# EAGLE design rcl_mini (EAGLE 8.0.1)
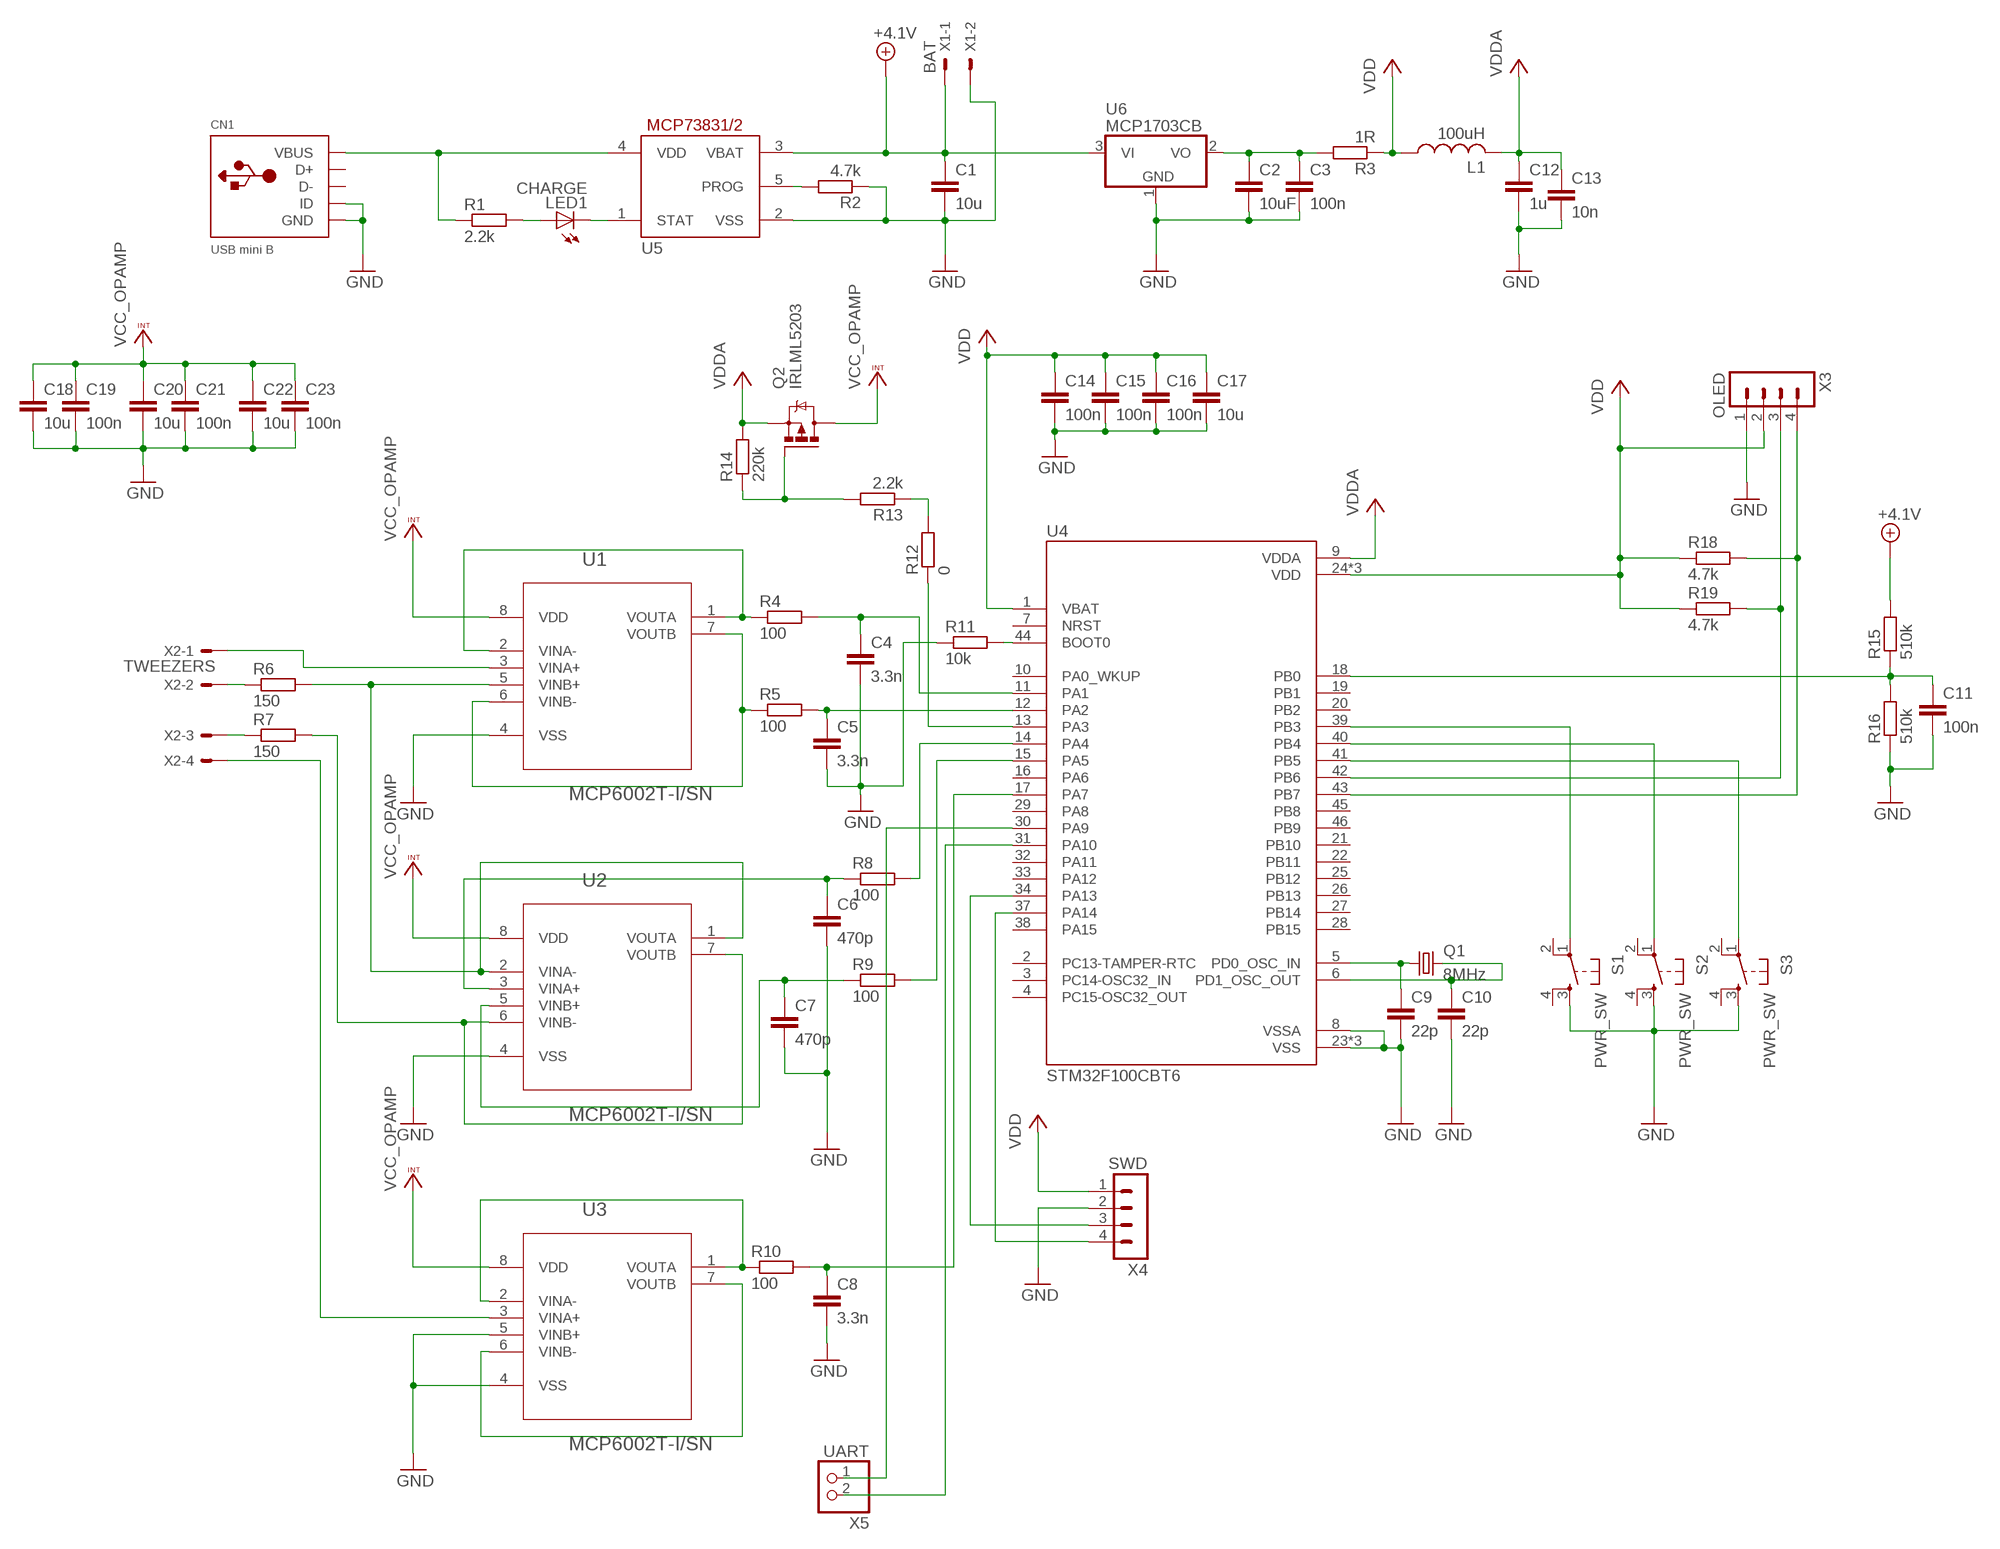
[diagram p0: schematic, sheet 1]

## Parts
C1  10u  C-EUC0805  [C0805]
C2  10uF  C-EUC0805  [C0805]
C3  100n  C-EUC0805  [C0805]
C4  3.3n  C-EUC0805  [C0805]
C5  3.3n  C-EUC0805  [C0805]
C6  470p  C-EUC0805  [C0805]
C7  470p  C-EUC0805  [C0805]
C8  3.3n  C-EUC0805  [C0805]
C9  22p  C-EUC0805  [C0805]
C10  22p  C-EUC0805  [C0805]
C11  100n  C-EUC0805  [C0805]
C12  1u  C-EUC0805  [C0805]
C13  10n  C-EUC0805  [C0805]
C14  100n  C-EUC0805  [C0805]
C15  100n  C-EUC0805  [C0805]
C16  100n  C-EUC0805  [C0805]
C17  10u  C-EUC0805  [C0805]
C18  10u  C-EUC0805  [C0805]
C19  100n  C-EUC0805  [C0805]
C20  10u  C-EUC0805  [C0805]
C21  100n  C-EUC0805  [C0805]
C22  10u  C-EUC0805  [C0805]
C23  100n  C-EUC0805  [C0805]
CN1  USB mini B  USBMINIB  [USB-MINIB]
L1  100uH  L-USL3216C  [L3216C]
LED1  CHARGE  LEDCHIPLED_1206  [CHIPLED_1206]
Q1  8MHz  CRYSTALHC49UP  [HC49UP]
Q2  IRLML5203  [MICRO3]
R1  2.2k  R-EU_M0805  [M0805]
R2  4.7k  R-EU_M0805  [M0805]
R3  1R  R-EU_M0805  [M0805]
R4  100  R-EU_M0805  [M0805]
R5  100  R-EU_M0805  [M0805]
R6  150  R-EU_M0805  [M0805]
R7  150  R-EU_M0805  [M0805]
R8  100  R-EU_M0805  [M0805]
R9  100  R-EU_M0805  [M0805]
R10  100  R-EU_M0805  [M0805]
R11  10k  R-EU_M0805  [M0805]
R12  0  R-EU_R1206  [R1206]
R13  2.2k  R-EU_M0805  [M0805]
R14  220k  R-EU_M0805  [M0805]
R15  510k  R-EU_M0805  [M0805]
R16  510k  R-EU_M0805  [M0805]
R18  4.7k  R-EU_M0805  [M0805]
R19  4.7k  R-EU_M0805  [M0805]
S1  PWR_SW  DTS-6  [DTS-6]
S2  PWR_SW  DTS-6  [DTS-6]
S3  PWR_SW  DTS-6  [DTS-6]
U1  MCP6002T-I/SN  MCP6002-E/SN  [SOIC127P600X175-8N]
U2  MCP6002T-I/SN  MCP6002-E/SN  [SOIC127P600X175-8N]
U3  MCP6002T-I/SN  MCP6002-E/SN  [SOIC127P600X175-8N]
U4  STM32F100CBT6  STM32F103C8T6  [QFP50P900X900X160-48N]
U5  MCP73831/OT  [SOT23-5L]
U6  MCP1703CB  [SOT23]
UART  X5  PINHD-1X2  [1X02]
X1  BAT  22-23-2021  [22-23-2021]
X2  TWEEZERS  22-23-2041  [22-23-2041]
X3  OLED  MA04-1  [MA04-1]
X4  SWD  MA04-1  [MA04-1]

## Nets
GND [power]: C1.2 C2.2 C3.2 C4.2 C5.2 C6.2 C7.2 C8.2 C9.2 C10.2 C11.2 C12.2 C13.2 C14.2 C15.2 C16.2 C17.2 C18.2 C19.2 C20.2 C21.2 C22.2 C23.2 CN1.GND CN1.ID R2.1 R11.1 R16.1 S1.3 S2.3 S3.3 U1.4(VSS) U2.4(VSS) U3.4(VSS) U3.5(VINB+) U4.8(VSSA) U4.23(VSS) U4.35(VSS) U4.47(VSS) U5.2(VSS) U6.1(GND) X1.2 X3.1 X4.2
HCUR: R7.1 X2.3
HCUR2: R7.2 U2.6(VINB-) U2.7(VOUTB)
HPOT: U3.3(VINA+) X2.4
LCUR: R6.1 X2.2
LCUR2: R6.2 U1.5(VINB+) U2.1(VOUTA) U2.2(VINA-)
N$1: R12.2 R13.1
N$2: LED1.A R1.2
N$3: LED1.C U5.1(STAT)
N$4: R2.2 U5.5(PROG)
N$5: C2.1 C3.1 R3.2 U6.2(VO)
N$6: R4.1 U1.1(VOUTA) U1.2(VINA-)
N$7: U1.3(VINA+) X2.1
N$10: R5.1 U1.6(VINB-) U1.7(VOUTB)
N$11: C6.1 R8.1 U2.3(VINA+)
N$12: R11.2 U4.44(BOOT0)
N$15: Q2.1(G) R13.2 R14.1
N$16: C7.1 R9.1 U2.5(VINB+)
N$19: R10.1 U3.1(VOUTA) U3.2(VINA-)
N$20: C11.1 R15.1 R16.2 U4.18(PB0)
N$21: U3.6(VINB-) U3.7(VOUTB)
N$23: C9.1 Q1.1 U4.5(PD0_OSC_IN)
N$24: C10.1 Q1.2 U4.6(PD1_OSC_OUT)
OLED_I2C_SCK: R19.2 U4.42(PB6) X3.3
OLED_I2C_SDA: R18.2 U4.43(PB7) X3.4
PA1: C4.1 R4.2 U4.11(PA1)
PA2: C5.1 R5.2 U4.12(PA2)
PA3: R12.1 U4.13(PA3)
PA4: R8.2 U4.14(PA4)
PA5: R9.2 U4.15(PA5)
PA7: C8.1 R10.2 U4.17(PA7)
SW1: S1.1 U4.39(PB3)
SW2: S2.1 U4.40(PB4)
SW3: S3.1 U4.41(PB5)
SWCLK: U4.37(PA14) X4.4
SWDIO: U4.34(PA13) X4.3
UART_RX: U4.31(PA10) UART.2
UART_TX: U4.30(PA9) UART.1
USB+: CN1.VBUS R1.1 U5.4(VDD)
VBAT+: C1.1 R15.2 U5.3(VBAT) U6.3(VI) X1.1 ; supply symbol labelled +4.1V
VCC_OPAMP [power]: C18.1 C19.1 C20.1 C21.1 C22.1 C23.1 Q2.3(D) U1.8(VDD) U2.8(VDD) U3.8(VDD)
VDD: C14.1 C15.1 C16.1 C17.1 L1.1 R3.1 R18.1 R19.1 U4.1(VBAT) U4.24(VDD) U4.36(VDD) U4.48(VDD) X3.2 X4.1
VDDA: C12.1 C13.1 L1.2 Q2.2(S) R14.2 U4.9(VDDA)
Unconnected: CN1.D+ CN1.D- S1.2 S1.4 S2.2 S2.4 S3.2 S3.4 U4.2(PC13-TAMPER-RTC) U4.3(PC14-OSC32_IN) U4.4(PC15-OSC32_OUT) U4.7(NRST) U4.10(PA0_WKUP) U4.16(PA6) U4.19(PB1) U4.20(PB2) U4.21(PB10) U4.22(PB11) U4.25(PB12) U4.26(PB13) U4.27(PB14) U4.28(PB15) U4.29(PA8) U4.32(PA11) U4.33(PA12) U4.38(PA15) U4.45(PB8) U4.46(PB9)

## Library data of the parts
C1-C23 = rcl:C-EU: CAPACITOR, European symbol
CN1 = adafruit:USB: USB Connectors USBMINIB - Surface Mount Female Mini-B USB Connector 4UConnector: 06564 By microbuilder.eu Thru-hole RA Female Mini-B USB Connector 4UConnector: 18732 By ladyada.net
L1 = rcl:L-US: INDUCTOR, American symbol
LED1 = led:LED: LED OSRAM: - CHIPLED LG R971, LG N971, LY N971, LG Q971, LY Q971, LO R971, LY R971 LH N974, LH R974 LS Q976, LO Q976, LY Q976 LO Q996 - Hyper CHIPLED LW Q18S LB Q993, LB Q99A, LB R99A - SideLED LS A670, LO A670, LY A670, LG A670, LP A670 LB A673, LV A673, LT A673, LW A673 LH A674 LY A675 LS A676, LA A676, LO A676, LY A676, LW A676 LS A679, LY A679, LG A679 - Hyper Micro SIDELED® LS Y876, LA Y876, LO Y876, LY Y876 LT Y87S - SmartLED LW L88C, LW L88S LB L89C, LB L89S, LG L890 LS L89K, LO L89K, LY L89K LS L896, LA L896, LO L896, LY L896 - TOPLED LS T670, LO T670, LY T670, LG T670, LP T670 LSG T670, LSP T670, LSY T670, LOP T670, LYG T670 LG T671, LOG T671, LSG T671 LB T673, LV T673, LT T673, LW T673 LH T674 LS T676, LA T676, LO T676, LY T676, LB T676, LH T676, LSB T676, LW T676 LB T67C, LV T67C, LT T67C, LS T67K, LO T67K, LY T67K, LW E67C LS E67B, LA E67B, LO E67B, LY E67B, LB E67C, LV E67C, LT E67C LW T67C LS T679, LY T679, LG T679 LS T770, LO T770, LY T770, LG T770, LP T770 LB T773, LV T773, LT T773, LW T773 LH T774 LS E675, LA E675, LY E675, LS T675 LS T776, LA T776, LO T776, LY T776, LB T776 LHGB T686 LT T68C, LB T68C - Hyper Mini TOPLED® LB M676 - Mini TOPLED Santana® LG M470 LS M47K, LO M47K, LY M47K Source: http://www.osram.convergy.de LUXEON: - LUMILED® LXK2-PW12-R00, LXK2-PW12-S00, LXK2-PW14-U00, LXK2-PW14-V00 LXK2-PM12-R00, LXK2-PM12-S00, LXK2-PM14-U00 LXK2-PE12-Q00, LXK2-PE12-R00, LXK2-PE12-S00, LXK2-PE14-T00, LXK2-PE14-U00 LXK2-PB12-K00, LXK2-PB12-L00, LXK2-PB12-M00, LXK2-PB14-N00, LXK2-PB14-P00, LXK2-PB14-Q00 LXK2-PR12-L00, LXK2-PR12-M00, LXK2-PR14-Q00, LXK2-PR14-R00 LXK2-PD12-Q00, LXK2-PD12-R00, LXK2-PD12-S00 LXK2-PH12-R00, LXK2-PH12-S00 LXK2-PL12-P00, LXK2-PL12-Q00, LXK2-PL12-R00 Source: www.luxeon.com KINGBRIGHT: KA-3528ASYC Source: www.kingbright.com
Q1 = adafruit:CRYSTAL: CRYSTAL; OC_FARNELL: unknown; OC_NEWARK: unknown
Q2 = transistor-power:IRLML5203: HEXFET P-Channel Power MOSFET
R1-R16 R18 R19 = rcl:R-EU_: RESISTOR, European symbol
S1-S3 = switch-tact:DTS-6
U1-U3 = MCP6002:MCP6002-E/SN: Low-Power Op Amp; AVAILABILITY: Unavailable; DESCRIPTION: MCP6002 Series 6 V 1 MHz SMT Low-Power Operational Amplifier - SOIC-8; MF: Microchip; MP: MCP6002-E/SN; PACKAGE: SOIC-8 Microchip; PRICE: None
U4 = STM32F10xCx:STM32F103C8T6: Mainstream Performance line, ARM Cortex-M3 MCU with 64 Kbytes Flash, 72 MHz CPU, motor control, USB and CAN; AVAILABILITY: Unavailable; DESCRIPTION: Mainstream Performance line, ARM Cortex-M3 MCU with 64 Kbytes Flash, 72 MHz CPU, motor control, USB and CAN; MF: STMicroelectronics; MP: STM32F103C8T6; PACKAGE: LQFP-48 STMicroelectronics; PRICE: None
U5 = adafruit:MCP73831: MCP73831/2 Miniature Single-Cell, Fully Integrated Li-Ion, Li-Polymer Charge Management Controllers. Nice and small simple lipoly charge controller, with adjustable current and status output (LED) http://www.ladyada.net/library/pcb/eaglelibrary.html
U6 = linear:MCP1703: 250 mA, 16V, Low Quiescent Current LDO Regulator Source: http://ww1.microchip.com/downloads/en/DeviceDoc/22049b.pdf
UART = pinhead:PINHD-1X2: PIN HEADER
X1 = con-molex:22-23-2021: .100" (2.54mm) Center Header - 2 Pin; MF: MOLEX; MPN: 22-23-2021; OC_FARNELL: 1462926; OC_NEWARK: 25C3832
X2 = con-molex:22-23-2041: .100" (2.54mm) Center Header - 4 Pin; MF: MOLEX; MPN: 22-23-2041; OC_FARNELL: 1462920; OC_NEWARK: 38C0355
X3 X4 = con-lstb:MA04-1: PIN HEADER; OC_FARNELL: unknown; OC_NEWARK: unknown

## Net classes
0 default: width 0.4 mm
1 power: width 0.6 mm

## Board
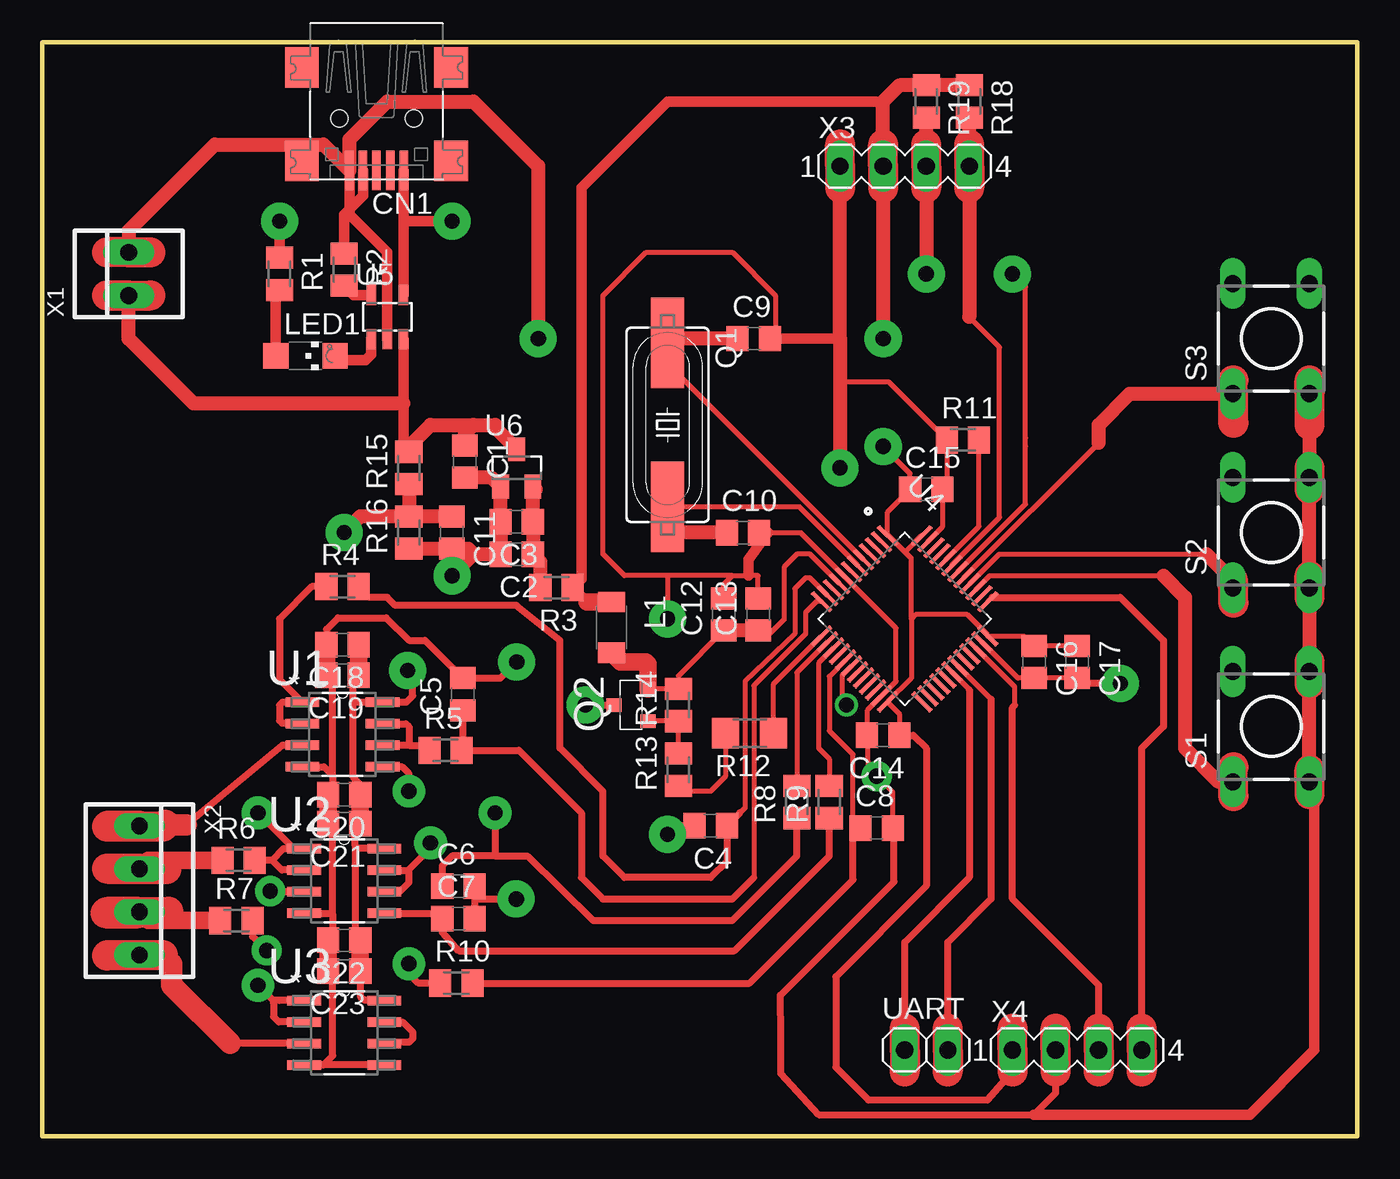
[diagram p1: board, top side]
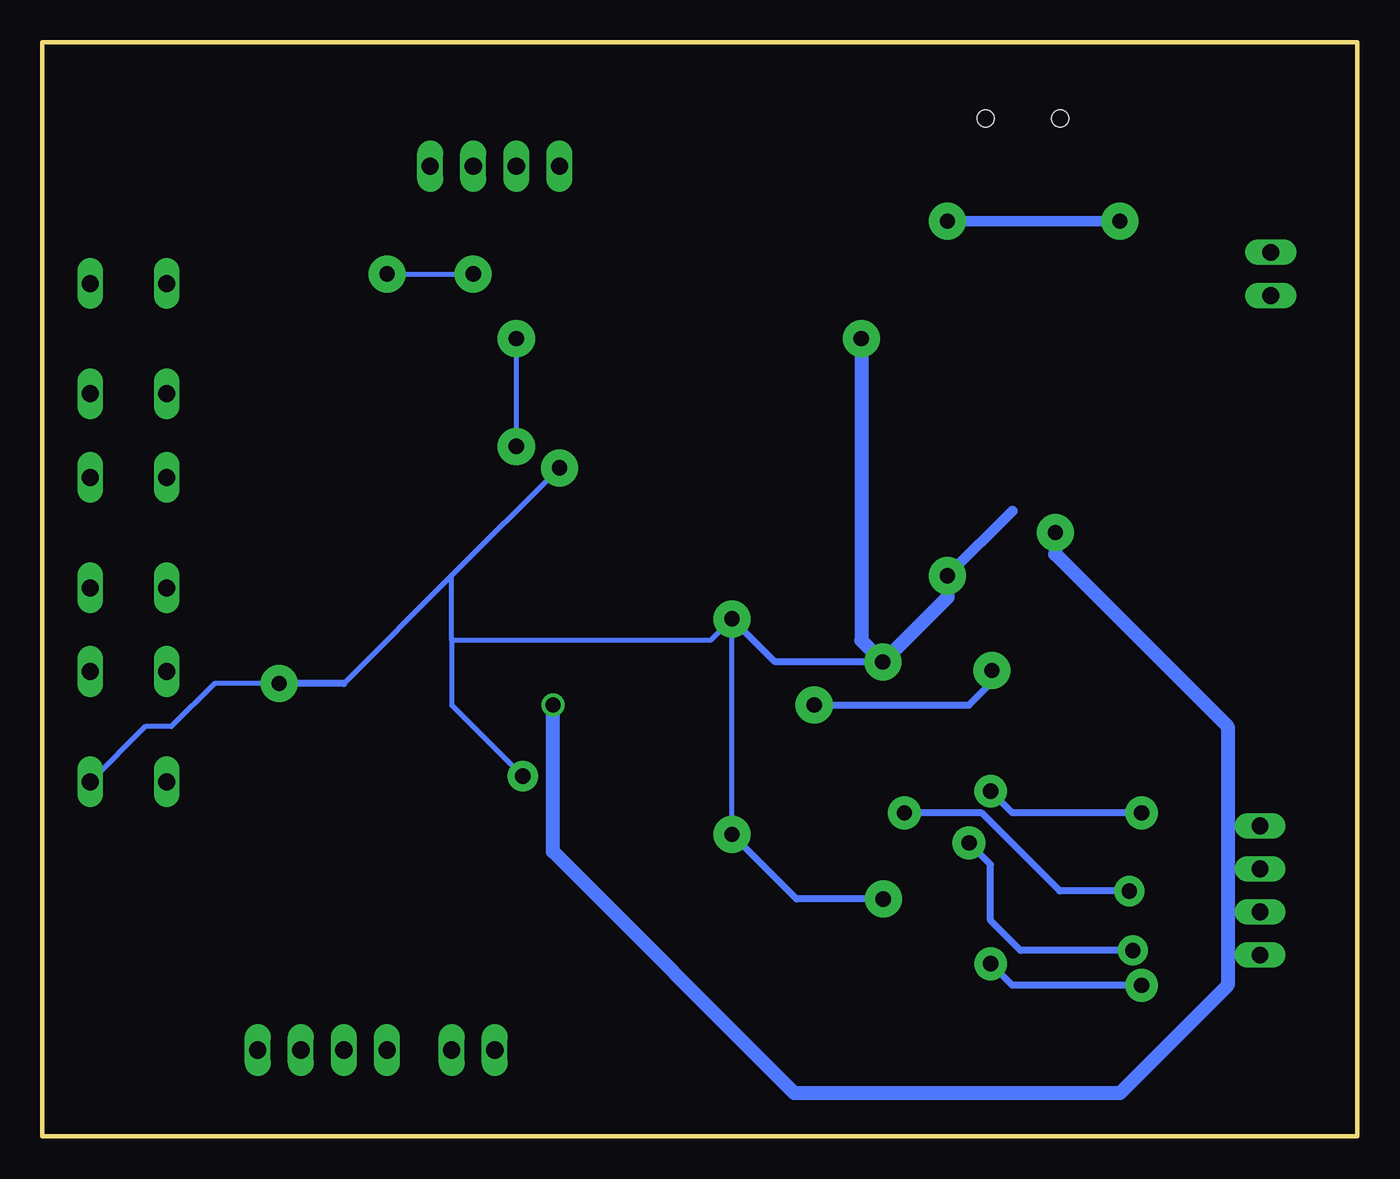
[diagram p2: board, bottom side, seen from below]

Size 77.45 x 64.44 mm. Coordinates in mm from the lower left corner, seen from the top.
Outline: 0,0 77.45,0 77.45,64.44 0,64.44 0,0
Copper layers (1*16): Top 0.035mm / dielectric 1.5mm / Bottom 0.035mm
Design rules "default": minimum track width 10mil, minimum drill 24mil, track to track 8mil, track to pad 8mil, pad to pad 8mil, via to via 8mil, smd to smd 8mil, copper to edge 40mil, drill to drill 8mil, minimum pad ring 10mil, minimum via ring 8mil, stop-mask expansion 4mil, vias tented up to drill 0mil, thermal gap 10mil

### Footprints (pad centres in the part's own frame; a part is rotated, then mirrored left to right if it is on the bottom)
C0805 = smd 1.3 x 1.5: 1 -0.95,0; 2 0.95,0
USB-MINIB = smd 0.5 x 2.308: D+ 0,4.064; D- -0.8,4.064; GND 1.6,4.064; ID 0.8,4.064; VBUS -1.6,4.064 | smd 2 x 2.4: GND1 -4.4,-2; GND2 -4.4,3.5; GND3 4.4,3.5; GND4 4.4,-2 | hole 1: -2.2,1; 2.2,1
L3216C = smd 1.2 x 1.6: 1 -1.5,0; 2 1.5,0
CHIPLED_1206 = smd 1.5 x 1.5: A 0,-1.75; C 0,1.75
HC49UP = smd 5.334 x 1.93: 1 -4.826,0; 2 4.826,0
MICRO3 = smd 0.8 x 0.9: 1 -0.95,-1; 2 0.95,-1; 3 0,1
M0805 = smd 1.3 x 1.6: 1 -0.95,0; 2 0.95,0
R1206 = smd 1.6 x 1.803: 1 -1.422,0; 2 1.422,0
DTS-6 = drill 1 long: 1 -3.25,2.25; 2 3.25,2.25; 3 -3.25,-2.25; 4 3.25,-2.25
SOIC127P600X175-8N = smd 1.981 x 0.559: 1 -2.362,1.905; 2 -2.362,0.635; 3 -2.362,-0.635; 4 -2.362,-1.905; 5 2.362,-1.905; 6 2.362,-0.635; 7 2.362,0.635; 8 2.362,1.905
QFP50P900X900X160-48N = smd 1.56 x 0.28: 1 -4.18,2.75; 2 -4.18,2.25; 3 -4.18,1.75; 4 -4.18,1.25; 5 -4.18,0.75; 6 -4.18,0.25; 7 -4.18,-0.25; 8 -4.18,-0.75; 9 -4.18,-1.25; 10 -4.18,-1.75; 11 -4.18,-2.25; 12 -4.18,-2.75; 25 4.18,-2.75; 26 4.18,-2.25; 27 4.18,-1.75; 28 4.18,-1.25; 29 4.18,-0.75; 30 4.18,-0.25; 31 4.18,0.25; 32 4.18,0.75; 33 4.18,1.25; 34 4.18,1.75; 35 4.18,2.25; 36 4.18,2.75 | smd 0.28 x 1.56: 13 -2.75,-4.18; 14 -2.25,-4.18; 15 -1.75,-4.18; 16 -1.25,-4.18; 17 -0.75,-4.18; 18 -0.25,-4.18; 19 0.25,-4.18; 20 0.75,-4.18; 21 1.25,-4.18; 22 1.75,-4.18; 23 2.25,-4.18; 24 2.75,-4.18; 37 2.75,4.18; 38 2.25,4.18; 39 1.75,4.18; 40 1.25,4.18; 41 0.75,4.18; 42 0.25,4.18; 43 -0.25,4.18; 44 -0.75,4.18; 45 -1.25,4.18; 46 -1.75,4.18; 47 -2.25,4.18; 48 -2.75,4.18
SOT23-5L = smd 0.55 x 1.2: 1 -0.95,-1.3; 2 0,-1.3; 3 0.95,-1.3; 4 0.95,1.3; 5 -0.95,1.3
SOT23 = smd 1 x 1.4: 1 -0.95,-1.1; 2 0.95,-1.1; 3 0,1.1
1X02 = drill 1.016 long: 1 -1.27,0; 2 1.27,0
22-23-2021 = drill 1 long: 1 -1.27,0; 2 1.27,0
22-23-2041 = drill 1 long: 1 -3.81,0; 2 -1.27,0; 3 1.27,0; 4 3.81,0
MA04-1 = drill 1.016 long: 1 -3.81,0; 2 -1.27,0; 3 1.27,0; 4 3.81,0

### Placement (x,y rotation side)
C1  24.89,39.75 270 top
C2  27.94,34.29 180 top
C3  27.94,36.19 180 top
C4  39.37,18.29 180 top
C5  24.77,26.03 90 top
C6  24.51,14.73 0 top
C7  24.51,12.83 0 top
C8  49.15,18.16 0 top
C9  41.91,46.99 0 top
C10  41.27,35.56 0 top
C11  24.13,35.56 270 top
C12  40.13,30.73 90 top
C13  42.16,30.73 90 top
C14  49.53,23.62 180 top
C15  52.07,38.1 0 top
C16  58.42,27.94 270 top
C17  60.96,27.94 270 top
C18  17.68,28.96 180 top
C19  17.68,27.15 180 top
C20  17.78,20.11 180 top
C21  17.78,18.41 180 top
C22  17.78,11.54 180 top
C23  17.78,9.73 180 top
CN1  19.68,60.96 180 top
L1  33.53,29.97 270 top
LED1  15.49,45.97 270 top
Q1  36.83,41.91 270 top
Q2  34.67,25.4 90 top
R1  13.97,50.8 270 top
R2  17.78,51.05 270 top
R3  30.28,32.32 180 top
R4  17.68,32.38 0 top
R5  23.75,22.73 0 top
R6  11.56,16.26 0 top
R7  11.43,12.7 0 top
R8  44.45,19.68 90 top
R9  46.35,19.68 90 top
R10  24.38,9.02 0 top
R11  54.23,41.02 0 top
R12  41.66,23.75 180 top
R13  37.46,21.59 90 top
R14  37.46,25.4 90 top
R15  21.59,39.37 90 top
R16  21.59,35.56 90 top
R18  54.61,60.96 270 top
R19  52.07,60.96 270 top
S1  72.39,24.13 90 top
S2  72.39,35.56 90 top
S3  72.39,46.99 90 top
U1  17.68,23.66 0 top
U2  17.78,15.04 0 top
U3  17.78,6.1 0 top
U4  50.8,30.48 315 top
U5  20.32,48.26 0 top
U6  27.94,39.37 0 top
UART  52.07,5.08 0 top
X1  5.08,50.8 90 top
X2  5.71,14.48 270 top
X3  50.8,57.15 0 top
X4  60.96,5.08 0 top

### Tracks (layer width: path | path; a pad name or v marks a point on that pad's centre or on a via)
GND  (via drill 0.9 pad 1.78, 0.9 pad 2.18)
  Top 0.305: C10.2 42.75,35.56 44.66,35.56 U4.8 50.29,29.93 50.29,26.79 U4.23 48.58,25.08 C14.2 48.64,21.65 v49.15,21.21 50.1,20.26 C8.2 | 40.64,33.02 41.59,33.02 42.16,33.02 C13.2 | 40.64,33.02 36.83,33.02 | 36.83,33.02 34.29,33.02 33.02,34.29 33.02,49.53 35.56,52.07 40.64,52.07 43.18,49.53 43.18,47.31 C9.2 | C12.2 40.13,32.51 40.64,33.02 | U4.47 53.02,35.88 C15.2 53.28,38.36 R11.1 49.85,44.45 46.99,44.45 | U4.35 57.47,26.99 C16.2 C17.2 | 36.83,33.02 v36.83,30.48
  Top 0.406: C6.2 25.46,13.97 | 25.46,13.97 C7.2 | 25.46,13.97 v27.91,13.97 | C4.2 37.34,18.29 v36.83,17.78 | v27.94,27.94 26.98,26.98 C5.2 22.54,29.21 21.59,29.21 20.26,30.54 17.41,30.54 16.73,29.86 C18.2 | C8.2 50.16,18.09 50.16,14.99 43.48,8.3 43.51,5.87 43.51,3.68 45.72,1.27 58.42,1.27 59.69,2.54 59.69,3.81 | v63.5,26.67 61.28,26.67 C17.2 | 16.91,26.97 C19.2 17.11,26.77 17.11,21.24 | U3.5 U3.4 16.56,4.19 17.11,4.74 17.11,9.45 C23.2 | U2.4 17.02,13.13 17.11,13.04 | 17.11,13.04 17.11,11.82 C22.2 | 17.11,13.04 17.11,18.13 C21.2 | U1.4 16.59,21.75 17.11,21.24 | 17.11,21.24 17.11,20.39 C20.2
  Top 0.61: 41.59,33.02 41.59,33.97 42.75,35.56 | 18.09,54.61 CN1.GND | 18.09,54.61 18.09,54.3 20.32,52.07 U5.2 | CN1.ID 18.88,55.41 18.09,54.61 | R2.1 17.78,54.3 18.09,54.61 | 58.42,1.27 71.12,1.27 74.93,5.08 74.93,20.59 S1.3 | C9.2 46.99,46.99
  Top 0.813: v46.99,39.37 46.99,44.45 46.99,46.99 46.99,55.88 | 25.4,34.29 C2.2 C3.2 U6.1 26.46,38.8 C1.2 | v24.13,33.02 25.4,34.29 | R16.1 C11.2 25.08,34.61 25.4,34.29 | 74.64,41.91 74.64,39.37 | 74.64,33.02 74.64,38.1 | 74.64,31.75 74.64,27.94 | 74.64,21.59 74.64,26.67 | X1.2 5.08,53.34 10.16,58.42 16.56,58.42 CN1.GND 18.09,58.72 20.32,60.96 25.4,60.96 29.21,57.15 v29.21,46.99
  Top 1.016: C19.2 C18.2 | C20.2 C21.2 | C22.2 C23.2
  Top 1.778: 3.81,52.07 X1.2 6.35,52.07 | 59.69,3.81 X4.2 59.69,6.35 | 46.99,58.42 X3.1 46.99,55.88 | S3.3 74.64,44.52 74.66,44.54 74.66,43.76 S3.3 | S3.3 74.64,41.91 | 74.64,39.37 74.64,38.1 | 74.64,33.02 S2.3 74.64,31.75 | 74.64,27.94 74.64,26.67 | S1.3 74.64,20.16 74.66,20.14 74.66,20.86 S1.3 | S1.3 74.64,21.59
  Bottom 0.305: 53.34,33.02 v46.99,39.37 | 53.34,33.02 59.69,26.67 | v49.15,21.21 53.34,25.4 53.34,29.21 | 53.34,29.21 53.34,33.02 | 53.34,29.21 38.1,29.21 v36.83,30.48 v36.83,17.78 | v63.5,26.67 67.31,26.67 69.85,24.13 71.39,24.13 S1.3
  Bottom 0.406: v27.91,13.97 33.02,13.97 v36.83,17.78 | v27.94,27.94 34.29,27.94 v36.83,30.48 | S1.3 74.68,20.84 | 59.69,26.67 v63.5,26.67
  Bottom 0.61: 20.32,36.83 v24.13,33.02
  Bottom 0.813: v24.13,33.02 24.13,31.75 v27.94,27.94 29.21,29.21 v29.21,46.99
HCUR
  Top 1.016: R7.1 6.22,12.7 X2.3
  Top 1.778: X2.3 3.78,13.21 3.71,13.14 5.65,13.14 X2.3 | X2.3 7.38,13.21 7.41,13.24
HCUR2  (via drill 0.9 pad 1.78, 0.9 pad 1.93)
  Top 0.406: R7.2 12.38,11.77 v13.21,10.94 | v22.86,17.28 22.86,16.99 21.51,15.64 | 21.51,15.64 20.18,15.64 U2.7 | U2.6 21.05,14.41 21.59,14.94 21.59,15.56 21.51,15.64
  Bottom 0.406: v13.21,10.94 19.83,10.94 21.59,12.7 21.59,16.01 v22.86,17.28
HPOT
  Top 0.406: U3.3 11.05,5.46 | 7.62,10.16 7.11,10.67 X2.4
  Top 1.27: 11.05,5.46 7.62,8.89 7.62,10.16
  Top 1.778: 3.81,10.64 3.84,10.67 X2.4 7.11,10.67
LCUR
  Top 1.016: R6.1 6.22,16.26 X2.2
  Top 1.778: X2.2 3.81,15.75 X2.2 | X2.2 7.3,15.75 7.31,15.74
LCUR2  (via drill 0.9 pad 1.93)
  Top 0.406: 13.53,16.26 R6.2 | 13.53,16.26 14.21,16.94 U2.1 14.8,16.95 v12.7,19.05 | U2.2 14.11,15.67 13.53,16.26 | v21.59,20.32 21.59,21.36 21.21,21.74 20.06,21.74 U1.5
  Bottom 0.406: v12.7,19.05 20.32,19.05 v21.59,20.32
N$1
  Top 0.305: R12.2 40.23,21.18 39.37,20.32 37.78,20.32 R13.1
N$2
  Top 0.61: LED1.A 13.74,49.62 R1.2
N$3
  Top 0.61: U5.1 19.37,46.04 19.05,45.72 17.5,45.72 LED1.C
N$4
  Top 0.61: U5.5 18.32,49.56 R2.2
N$5
  Top 0.813: 29.06,38.1 U6.2 C3.1 C2.1 29.33,33.85 R3.2
N$6
  Top 0.406: R4.1 15.87,32.38 13.97,30.48 13.97,26.91 U1.1 14.13,25.56 13.97,25.4 13.97,24.48 14.11,24.34 15.27,24.34 U1.2
N$7
  Top 0.406: U1.3 14.13,23.02 8.46,18.35 | 4.78,18.35 X2.1
  Top 1.27: 8.46,18.35 4.78,18.35
  Top 1.778: X2.1 3.86,18.29 3.81,18.24 7.11,18.24 7.21,18.34
N$10
  Top 0.406: 21.59,23.02 U1.6 | 21.59,23.02 22.51,23.02 R5.1 | U1.7 21.43,24.29 21.59,24.13 21.59,23.02
N$11  (via drill 0.9 pad 1.78, 0.9 pad 1.93)
  Top 0.406: C6.1 23.56,15.94 24.13,16.51 26.67,16.51 | R8.1 44.45,16.51 40.64,12.7 32.45,12.7 28.58,16.51 26.67,16.51 | U2.3 13.45,14.41 v13.41,14.44 | v26.67,19.05 26.67,16.51
  Bottom 0.406: v13.41,14.44 17.51,14.44 22.11,19.04 v26.66,19.04 v26.67,19.05
N$12
  Top 0.305: U4.44 55.18,35.92 R11.2
N$15
  Top 0.305: Q2.1 R14.1 R13.2
N$16
  Top 0.406: R9.1 46.35,16.51 40.77,10.93 24.53,10.93 23.56,12 C7.1 23.25,13.13 U2.5
N$19  (via drill 0.9 pad 1.93)
  Top 0.406: U3.2 13.92,6.73 13.61,7.04 13.61,7.84 13.77,8 13.97,8 | U3.1 13.97,8 | 13.97,8 13.59,8 v12.7,8.89 | v21.59,10.16 21.59,9.56 22.11,9.04 23.41,9.04 R10.1
  Bottom 0.406: v12.7,8.89 20.32,8.89 v21.59,10.16
N$20  (via drill 0.9, 0.9 pad 2.18)
  Top 0.305: U4.18 47.12,27.15 47.12,25.4 v47.37,25.4
  Top 0.813: R15.1 R16.2 | C11.1 R16.2 | R16.2 18.73,36.51 v17.78,35.56
  Bottom 0.813: v17.78,35.56 17.78,34.29 7.62,24.13 7.62,8.89 13.97,2.54 33.15,2.54 47.37,16.76 v47.37,25.4
N$21
  Top 0.406: U3.7 21.22,6.73 21.81,6.14 21.81,5.74 21.61,5.54 20.22,5.54 U3.6
N$23
  Top 0.305: U4.5 36.83,45.51 Q1.1 37.08,46.99
  Top 0.813: C9.1 37.08,46.99
N$24
  Top 0.305: U4.6 48.02,33.64 44.58,37.08 Q1.2 36.83,35.56
  Top 0.813: C10.1 36.83,35.56
OLED_I2C_SCK  (via drill 0.9 pad 2.18)
  Top 0.305: U4.42 57.91,37.24 57.91,40.64 57.91,41.15 57.91,50.04 v57.15,50.8
  Top 0.813: 52.07,58.42 R19.2 | 52.07,55.88 v52.07,50.8
  Top 1.778: 52.07,58.42 X3.3 52.07,55.88
  Bottom 0.305: v57.15,50.8 v52.07,50.8
OLED_I2C_SDA
  Top 0.305: U4.43 53.58,33.64 56.39,36.45 56.39,46.48 54.61,48.26
  Top 0.813: 54.61,58.42 R18.2 | 54.61,55.88 54.61,48.26
  Top 1.778: 54.61,58.42 X3.4 54.61,55.88
PA1
  Top 0.305: U4.11 45.2,32.89 44.96,32.89 44.32,32.26 44.32,29.59 41.4,26.8 41.4,19.35 41.08,19.05
  Top 0.406: 41.08,19.05 C4.1 40.32,16.19 39.37,15.24 34.29,15.24 33.02,16.51 33.02,20.32 30.48,22.86 30.48,29.21 27.91,31.28 20.79,31.28 20.32,31.75 19.26,31.75 R4.2
PA2
  Top 0.305: U4.12 45.59,31.49 44.96,30.86 44.96,29.59 41.91,26.54 41.91,15.24
  Top 0.406: C5.1 24.77,22.8 R5.2 28.07,22.73 31.75,19.05 31.75,15.24 33.02,13.97 40.64,13.97 41.91,15.24
PA3
  Top 0.305: R12.1 43.08,26.65 U4.13
PA4
  Top 0.305: U4.14 44.45,27.31 R8.2
PA5
  Top 0.305: U4.15 45.72,27.88 45.72,22.86 46.35,22.22 R9.2
PA7
  Top 0.305: U4.17 46.35,27.1 46.35,23.88 47.75,22.48 47.75,18.16 | 47.75,18.16 47.75,17.14 | C8.1 47.75,18.16
  Top 0.406: C8.1 47.75,17.71 47.75,15.11 41.66,9.02 R10.2
SW1
  Top 0.305: U4.39 55.81,33.02 66.04,33.02
  Top 0.813: 66.04,33.02 67.31,31.75 67.31,22.86 69.29,20.88 S1.1
  Top 1.778: 70.16,21.74 70.14,21.72 S1.1 70.14,20.06 70.16,20.04
SW2
  Top 0.305: U4.40 56.38,34.29 68.58,34.29
  Top 0.813: 70.14,32.73 68.58,34.29
  Top 1.778: 70.14,32.73 S2.1 70.14,31.46 70.16,31.44
SW3
  Top 0.305: U4.41 62.23,40.85
  Top 0.813: 62.23,40.85 62.23,41.91 64.06,43.74 S3.1
  Top 1.778: 70.16,44.54 70.14,44.52 S3.1 70.14,42.06 70.16,42.04
SWCLK
  Top 0.305: 55.96,31.75 U4.37
  Top 0.406: 55.96,31.75 63.5,31.75 66.04,29.21 66.04,24.13 64.77,22.86 64.77,6.35
  Top 1.778: 64.77,6.35 X4.4 64.77,3.81
SWDIO
  Top 0.305: 57.28,25.4 57.28,26.48 U4.34
  Top 0.406: 62.23,6.35 62.23,8.89 57.15,13.97 57.15,25.27 57.28,25.4
  Top 1.778: 62.23,6.35 X4.3 62.23,3.81
UART_RX
  Top 0.305: U4.31 55.88,25.75
  Top 0.406: 53.34,6.35 53.34,11.43 55.88,13.97 55.88,25.75
  Top 1.778: 53.34,6.35 UART.2 53.34,3.81
UART_TX
  Top 0.305: U4.30 54.61,26.32
  Top 0.406: 50.8,6.35 50.8,11.43 54.61,15.24 54.61,26.32
  Top 1.778: 50.8,3.81 UART.1 50.8,6.35
USB+  (via drill 0.9 pad 2.18)
  Top 0.61: 21.27,53.91 U5.4 | 21.27,53.91 21.27,56.88 CN1.VBUS | R1.1 v13.97,53.91 | v24.13,53.91 21.27,53.91
  Bottom 0.61: v13.97,53.91 v24.13,53.91
VBAT+
  Top 0.61: 21.27,40.64 21.27,43.18 U5.3
  Top 0.813: 25.4,41.91 22.86,41.91 21.59,40.64 R15.2 21.27,40.64 | 25.4,41.91 26.67,41.91 26.67,41.74 U6.3 | 25.4,41.91 24.89,41.4 C1.1 | X1.1 5.08,46.99 8.89,43.18 21.27,43.18
  Top 1.778: X1.1 3.81,49.53 X1.1 | X1.1 6.35,49.53
VCC_OPAMP  (via drill 0.9 pad 2.18)
  Top 0.406: v31.98,25.4 Q2.3 | C23.1 18.73,8.22 18.91,8.04 20.1,8.04 U3.8 | 18.71,18.39 C21.1 18.41,18.09 18.41,17.14 | 18.61,27.13 C19.1 18.31,26.83 18.31,25.74 | 18.61,20.23 C20.1 18.73,20.72 18.31,21.14 18.31,25.74 | v21.51,27.44 21.81,27.14 21.81,25.94 21.43,25.56 U1.8 18.48,25.56 18.31,25.74 | U2.8 18.61,16.95 18.41,17.14 | 18.41,17.14 18.41,11.86 C22.1
  Top 1.016: C22.1 C23.1 | C21.1 C20.1 | C19.1 C18.1
  Bottom 0.406: v21.51,27.44 21.51,26.75 22.86,25.4 v31.98,25.4
VDD  (via drill 0.9 pad 2.18)
  Top 0.305: 50.8,34.42 49.84,35.38 U4.1 49.79,36.77 C15.1 51.12,39.05 v49.53,40.64 | 50.8,34.42 51.18,34.04 51.18,30.48 | 51.18,30.48 51.18,26.97 U4.24 50.48,24.89 C14.1 | 51.18,30.48 51.44,30.73 54.48,30.73 55.7,29.52 U4.36 57.84,29.47 C16.1 C17.1 | U4.48 51.76,35.38 50.8,34.42
  Top 0.406: C14.1 51.31,23.62 52.07,22.86 52.07,14.73 46.74,9.4 46.74,4.06 48.66,2.14 55.68,2.14 57.15,3.81
  Top 0.61: 49.53,60.96 36.83,60.96 31.75,55.88 31.75,32.84 R3.1 32.08,31.47
  Top 0.813: R18.1 R19.1 50.48,61.91 49.53,60.96 49.53,58.42 | 49.53,55.88 v49.53,46.99
  Top 1.016: L1.1 32.08,31.47
  Top 1.778: 57.15,3.81 X4.1 57.15,6.35 | 49.53,58.42 X3.2 49.53,55.88
  Bottom 0.305: v49.53,40.64 v49.53,46.99
VDDA
  Top 0.305: U4.9 45.22,34.29 44.45,34.29 43.69,33.53 43.69,30.43 42.64,29.38 C13.1 | C12.1 37.46,27.12 R14.2 Q2.2
  Top 0.813: C13.1 C12.1
  Top 1.016: Q2.2 35.67,27.83 35.56,27.94 34.06,27.94 L1.2